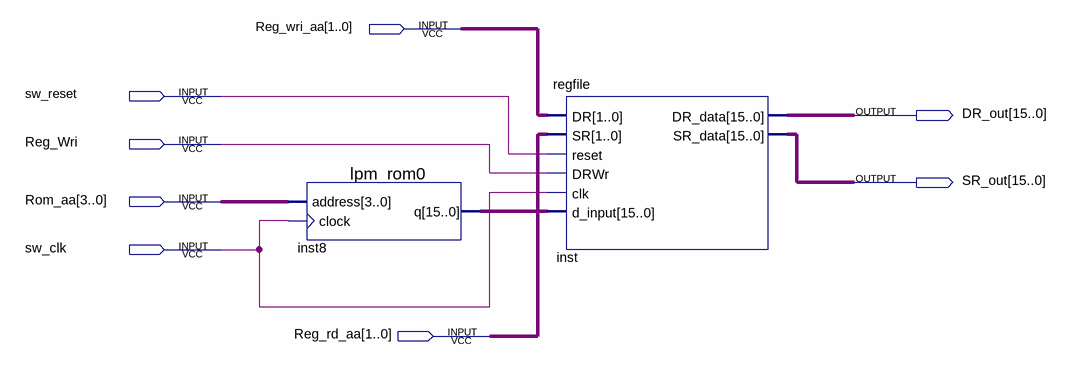
[diagram p0: schematic sheet]
// Quartus schematic REG.bdf as structural Verilog: 2 symbols, 8 pins
module REG (
  input  [1:0] Reg_wri_aa,
  input  sw_reset,
  input  Reg_Wri,
  input  [3:0] Rom_aa,
  input  sw_clk,
  input  [1:0] Reg_rd_aa,
  output [15:0] DR_out,
  output [15:0] SR_out
);

  wire [15:0] inst8_q;

  lpm_rom0 inst8 (.address(Rom_aa), .clock(sw_clk), .q(inst8_q));
  regfile inst (
    .DR(Reg_wri_aa), .SR(Reg_rd_aa), .reset(sw_reset), .DRWr(Reg_Wri), .clk(sw_clk), .d_input(inst8_q),
    .DR_data(DR_out), .SR_data(SR_out));
endmodule
